# EAGLE design input-shield_for_Adafruit_HUZZAH32_ESP32_Feather (EAGLE 9.4.0)
COMPANY: PIKSU TECH; DRAWN: KTOWN; REV: A; TITLE: INPUT SHIELD; YEAR: 2019
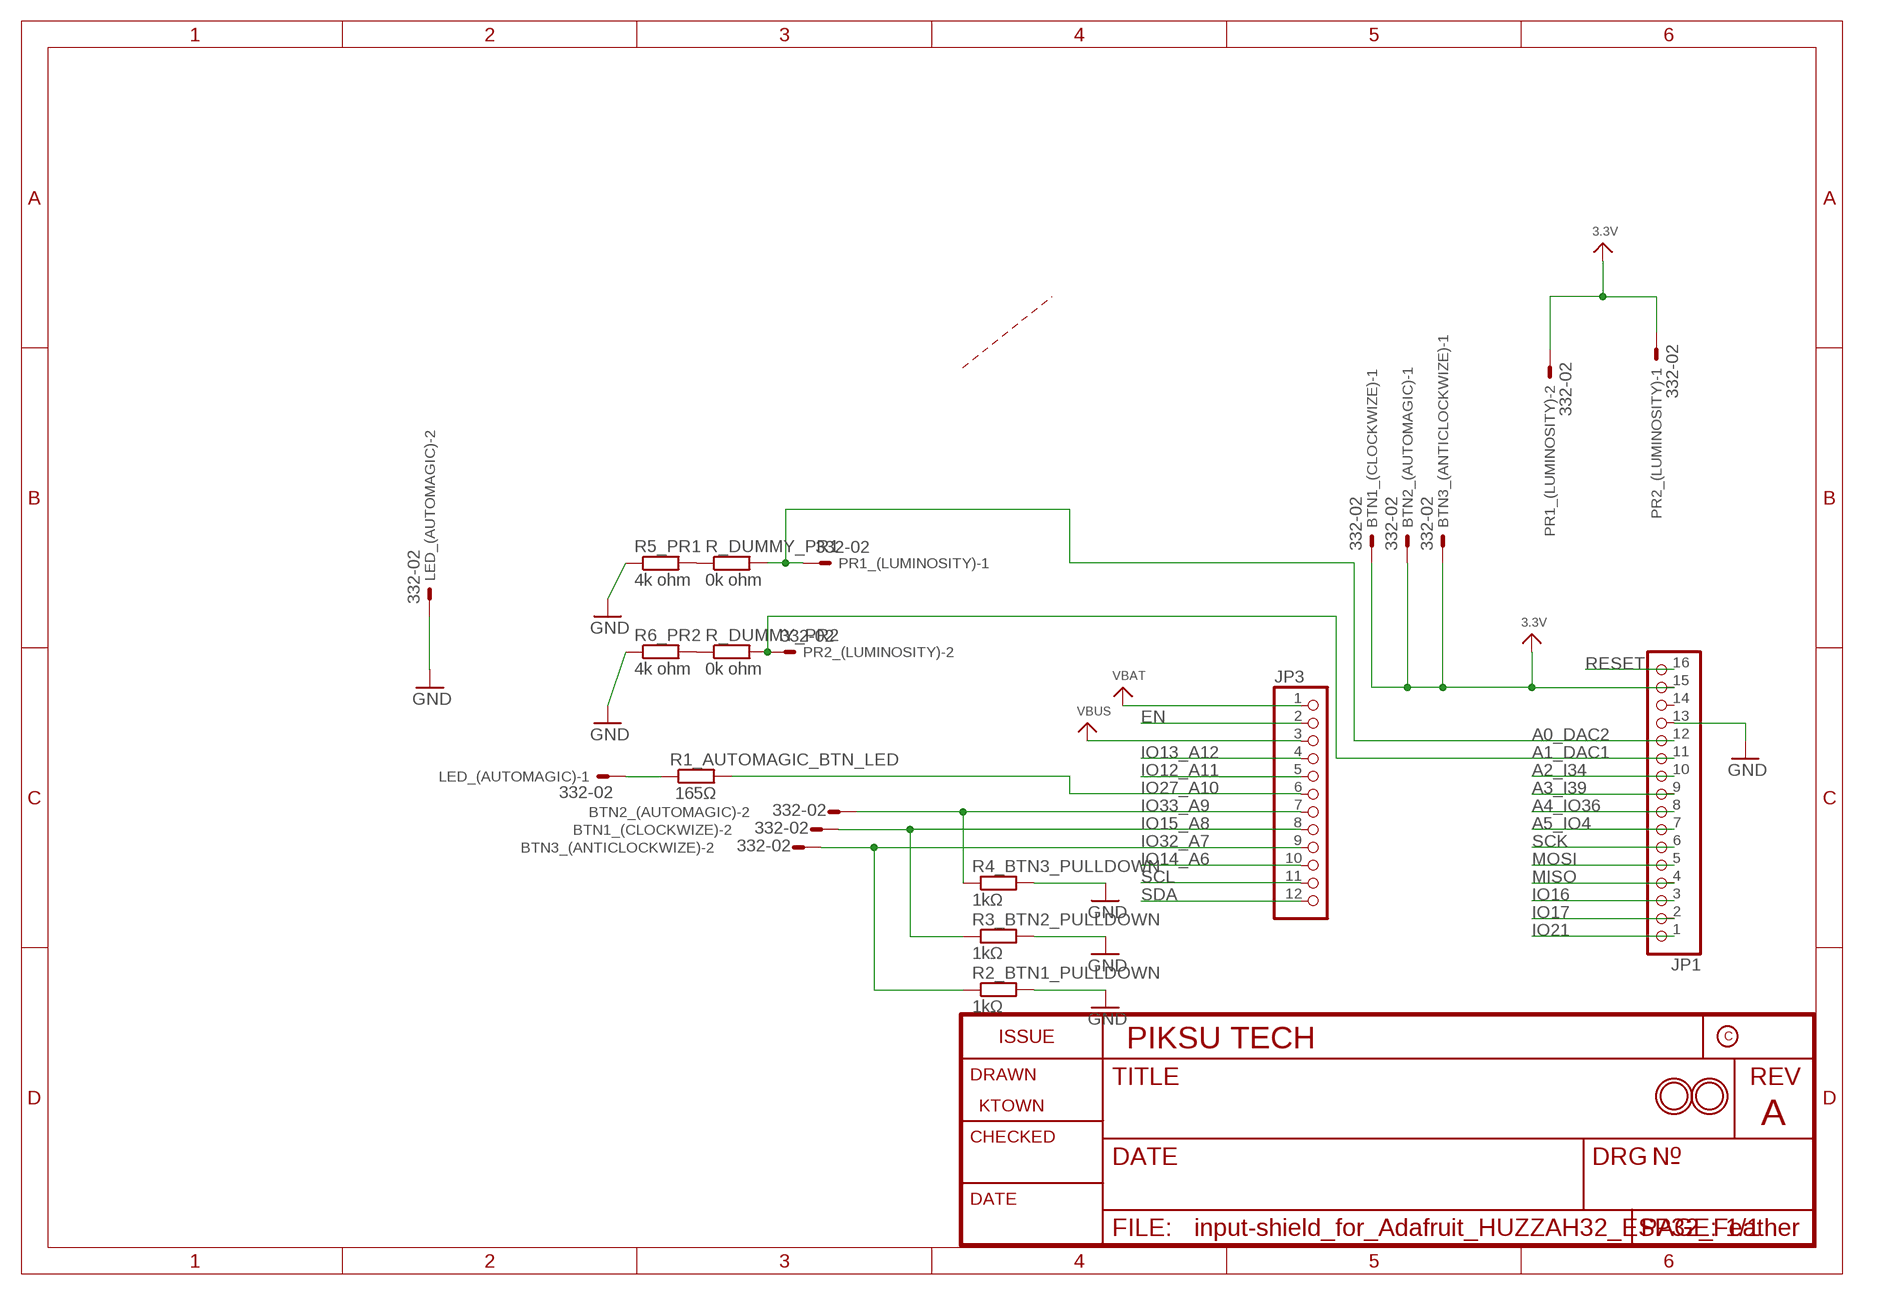
[diagram p0: schematic, sheet 1]

## Parts
BTN1_(CLOCKWIZE)  332-02  [332-02]
BTN2_(AUTOMAGIC)  332-02  [332-02]
BTN3_(ANTICLOCKWIZE)  332-02  [332-02]
JP1  HEADER-1X16_MIN  [1X16_ROUND_MIN]
JP3  HEADER-1X12_MIN  [1X12_ROUND_MIN]
LED_(AUTOMAGIC)  332-02  [332-02]
PR1_(LUMINOSITY)  332-02  [332-02]
PR2_(LUMINOSITY)  332-02  [332-02]
R1_AUTOMAGIC_BTN_LED  165Ω  R-EU_0204/7  [0204/7]
R2_BTN1_PULLDOWN  1kΩ  R-EU_0204/7  [0204/7]
R3_BTN2_PULLDOWN  1kΩ  R-EU_0204/7  [0204/7]
R4_BTN3_PULLDOWN  1kΩ  R-EU_0204/7  [0204/7]
R5_PR1  4k ohm  R-EU_0204/7  [0204/7]
R6_PR2  4k ohm  R-EU_0204/7  [0204/7]
R_DUMMY_PR1  0k ohm  R-EU_0204/7  [0204/7]
R_DUMMY_PR2  0k ohm  R-EU_0204/7  [0204/7]
U$31  MOUNTINGHOLE2.5  [MOUNTINGHOLE_2.5_PLATED]
U$32  MOUNTINGHOLE2.5  [MOUNTINGHOLE_2.5_PLATED]

## Nets
3.3V: BTN1_(CLOCKWIZE).1 BTN2_(AUTOMAGIC).1 BTN3_(ANTICLOCKWIZE).1 JP1.15 PR1_(LUMINOSITY).2 PR2_(LUMINOSITY).1
A0_DAC2: JP1.12 PR1_(LUMINOSITY).1 R_DUMMY_PR1.2
A1_DAC1: JP1.11 PR2_(LUMINOSITY).2 R_DUMMY_PR2.2
A2_I34: JP1.10
A3_I39: JP1.9
A4_IO36: JP1.8
A5_IO4: JP1.7
EN: JP3.2
GND: JP1.13 LED_(AUTOMAGIC).2 R2_BTN1_PULLDOWN.2 R3_BTN2_PULLDOWN.2 R4_BTN3_PULLDOWN.2 R5_PR1.1 R6_PR2.1
IO12_A11: JP3.5
IO13_A12: JP3.4
IO14_A6: JP3.10
IO15_A8: BTN1_(CLOCKWIZE).2 JP3.8 R3_BTN2_PULLDOWN.1
IO16: JP1.3
IO17: JP1.2
IO21: JP1.1
IO27_A10: JP3.6 R1_AUTOMAGIC_BTN_LED.2
IO32_A7: BTN3_(ANTICLOCKWIZE).2 JP3.9 R2_BTN1_PULLDOWN.1
IO33_A9: BTN2_(AUTOMAGIC).2 JP3.7 R4_BTN3_PULLDOWN.1
MISO: JP1.4
MOSI: JP1.5
N$1: LED_(AUTOMAGIC).1 R1_AUTOMAGIC_BTN_LED.1
N$4: R5_PR1.2 R_DUMMY_PR1.1
N$5: R6_PR2.2 R_DUMMY_PR2.1
RESET: JP1.16
SCK: JP1.6
SCL: JP3.11
SDA: JP3.12
VBAT: JP3.1
VBUS: JP3.3
Unconnected: JP1.14

## Library data of the parts
BTN1_(CLOCKWIZE) BTN2_(AUTOMAGIC) BTN3_(ANTICLOCKWIZE) LED_(AUTOMAGIC) PR1_(LUMINOSITY) PR2_(LUMINOSITY) = con-garry:332-02: 2 Pin - 2mm Dual Row Source: www.mpe-connector.de / garry_shortform_2012.pdf
JP1 = microbuilder:HEADER-1X16: PIN HEADER
JP3 = microbuilder:HEADER-1X12
R1_AUTOMAGIC_BTN_LED R2_BTN1_PULLDOWN R3_BTN2_PULLDOWN R4_BTN3_PULLDOWN R5_PR1 R6_PR2 R_DUMMY_PR1 R_DUMMY_PR2 = rcl:R-EU_: RESISTOR, European symbol; SPICEPREFIX: R
U$31 U$32 = microbuilder:MOUNTINGHOLE: Mounting Hole For #2 screws (0.086"/2.18mm width, 0.094"/2.4mm hole) use 2.5mm; BOM: EXCLUDE

## Board
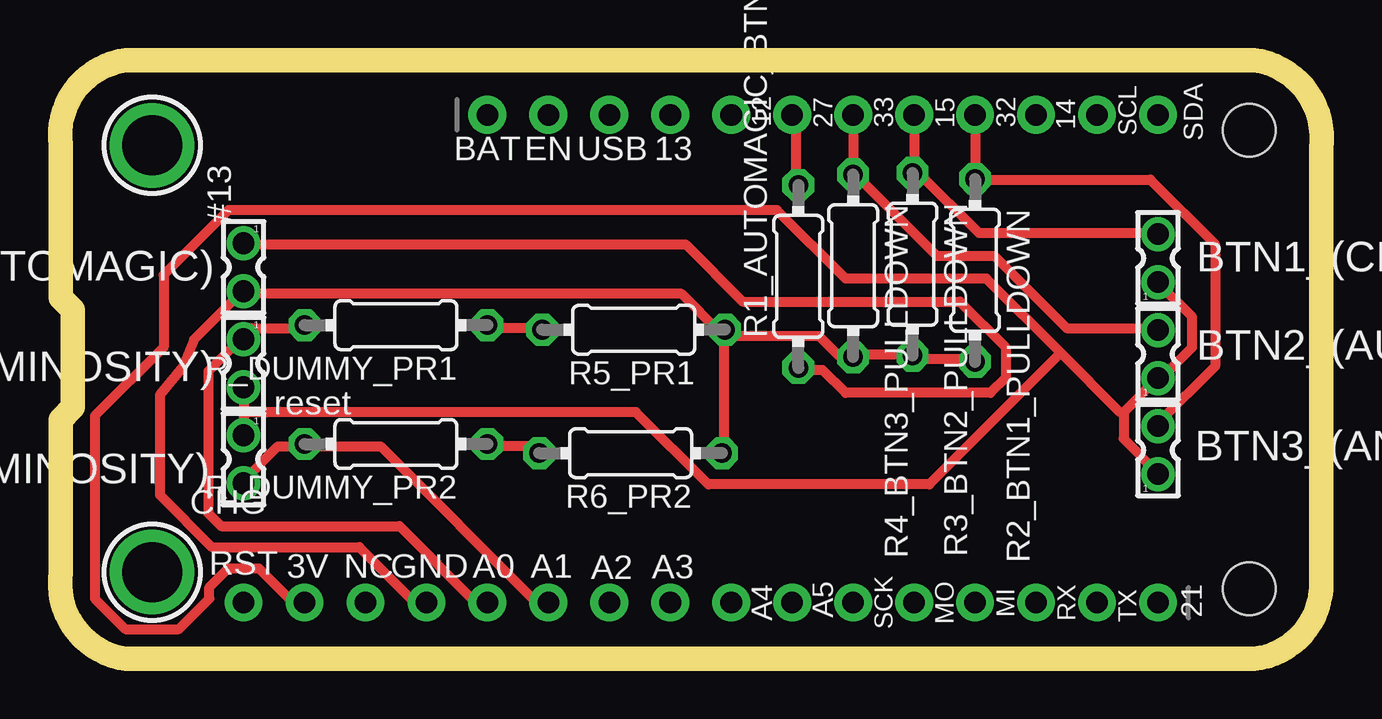
[diagram p1: board, top side]

Size 52.57 x 24.96 mm. Coordinates in mm from the lower left corner, seen from the top.
Outline: 2.76,0 49.75,0 arc90 52.54,3.49 52.54,21.27 arc90 49.75,24.96 2.76,24.96 arc90 0.03,21.4 0.03,15.05 0.54,14.54 0.54,10.48 0.03,9.97 0.03,3.62 arc90 2.76,0
Copper layers (1*16): Top 0.035mm / dielectric 1.5mm / Bottom 0.035mm
Design rules "adafruit 7-7 *": minimum track width 16mil, minimum drill 15.5mil, track to track 16mil, track to pad 16mil, pad to pad 16mil, via to via 16mil, smd to smd 7mil, copper to edge 10mil, drill to drill 8mil, minimum pad ring 10mil, minimum via ring 8mil, stop-mask expansion 2mil, vias tented up to drill 20mil, thermal gap 10mil
Holes 2.2 mm at 49.56,2.92 49.56,22.03

### Footprints (pad centres in the part's own frame; a part is rotated, then mirrored left to right if it is on the bottom)
332-02 = drill 0.9 pad 1.27: 1 0,-1; 2 0,1
1X16_ROUND_MIN = drill 0.9 pad 1.575: 1 -19.05,0; 2 -16.51,0; 3 -13.97,0; 4 -11.43,0; 5 -8.89,0; 6 -6.35,0; 7 -3.81,0; 8 -1.27,0; 9 1.27,0; 10 3.81,0; 11 6.35,0; 12 8.89,0; 13 11.43,0; 14 13.97,0; 15 16.51,0; 16 19.05,0
1X12_ROUND_MIN = drill 0.9 pad 1.575: 1 -13.97,0; 2 -11.43,0; 3 -8.89,0; 4 -6.35,0; 5 -3.81,0; 6 -1.27,0; 7 1.27,0; 8 3.81,0; 9 6.35,0; 10 8.89,0; 11 11.43,0; 12 13.97,0
0204/7 = drill 0.813 octagon: 1 -3.81,0; 2 3.81,0
MOUNTINGHOLE_2.5_PLATED = drill 2.5 pad 3.2: P$1 0,0

### Placement (x,y rotation side)
BTN1_(CLOCKWIZE)  45.75,16.7 0 top
BTN2_(AUTOMAGIC)  45.75,12.7 0 top
BTN3_(ANTICLOCKWIZE)  45.75,8.7 0 top
JP1  26.7,2.35 180 top
JP3  31.78,22.67 0 top
LED_(AUTOMAGIC)  7.65,16.32 180 top
PR1_(LUMINOSITY)  7.65,12.32 180 top
PR2_(LUMINOSITY)  7.65,8.32 180 top
R1_AUTOMAGIC_BTN_LED  30.76,15.94 90 top
R2_BTN1_PULLDOWN  38.13,16.19 270 top
R3_BTN2_PULLDOWN  35.52,16.45 270 top
R4_BTN3_PULLDOWN  33.05,16.38 270 top
R5_PR1  23.9,13.72 180 top
R6_PR2  23.78,8.57 180 top
R_DUMMY_PR1  14,13.91 180 top
R_DUMMY_PR2  14,8.95 180 top
U$31  3.84,21.4 270 top
U$32  3.84,3.62 270 top

### Tracks (layer width: path | path; a pad name or v marks a point on that pad's centre or on a via)
3.3V
  Top 0.406: PR1_(LUMINOSITY).2 7.65,10.29 | 7.65,10.29 PR2_(LUMINOSITY).1 | 44.32,10.29 44.32,9.18 45.75,7.75 BTN3_(ANTICLOCKWIZE).1 | 44.32,10.29 45.75,11.72 BTN2_(AUTOMAGIC).1 45.91,11.72 47.18,12.99 47.18,14.26 45.75,15.68 BTN1_(CLOCKWIZE).1 | JP1.15 9.71,2.35 8.28,3.78 7.01,3.78 6.22,2.98 6.22,2.51 4.95,1.24 2.73,1.24 1.46,2.51 1.46,10.13 4.31,12.99 4.31,16 7.01,18.7 29.87,18.7 32.73,15.84 38.6,15.84 41.7,12.75 | 41.7,12.75 44.16,10.29 44.32,10.29 | 7.65,10.29 24,10.29 27.02,7.27 36.22,7.27 41.7,12.75
A0_DAC2
  Top 0.406: R_DUMMY_PR1.2 10.19,13.78 7.97,13.78 7.65,13.46 PR1_(LUMINOSITY).1 7.49,13.3 6.18,11.99 6.18,6.06 6.71,5.53 14.15,5.53 17.33,2.35 JP1.12
A1_DAC1
  Top 0.406: PR2_(LUMINOSITY).2 7.65,7.43 9.08,8.86 10.19,8.86 R_DUMMY_PR2.2 10.35,8.86 13.36,8.86 19.87,2.35 JP1.11
GND
  Top 0.406: R2_BTN1_PULLDOWN.2 38.13,12.51 35.59,12.51 R3_BTN2_PULLDOWN.2 35.43,12.67 33.05,12.67 R4_BTN3_PULLDOWN.2 32.89,12.67 32.41,12.67 31.62,13.46 27.81,13.46 R5_PR1.1 | R6_PR2.1 27.65,8.7 27.65,13.62 R5_PR1.1 | R5_PR1.1 27.49,13.62 25.9,15.21 7.65,15.21 LED_(AUTOMAGIC).2 7.49,15.21 5.59,13.31 5.13,12.19 4.16,11.01 4.16,6.83 6.33,4.66 12.48,4.66 14.79,2.35 JP1.13
IO15_A8
  Top 0.406: JP3.8 35.59,20.29 R3_BTN2_PULLDOWN.1 35.75,20.29 38.29,17.75 45.75,17.75 BTN1_(CLOCKWIZE).2
IO27_A10
  Top 0.406: JP3.6 30.67,22.51 30.67,19.81 R1_AUTOMAGIC_BTN_LED.2
IO32_A7
  Top 0.406: JP3.9 R2_BTN1_PULLDOWN.1 38.29,19.97 45.43,19.97 48.13,17.27 48.13,12.19 45.75,9.81 BTN3_(ANTICLOCKWIZE).2
IO33_A9
  Top 0.406: JP3.7 R4_BTN3_PULLDOWN.1 33.21,20.13 36.54,16.8 38.92,16.8 41.94,13.78 45.75,13.78 BTN2_(AUTOMAGIC).2
N$1
  Top 0.406: R1_AUTOMAGIC_BTN_LED.1 30.82,12.03 31.78,12.03 32.73,11.08 38.76,11.08 39.4,11.72 39.4,12.99 37.49,14.89 28.44,14.89 26.06,17.27 7.65,17.27 LED_(AUTOMAGIC).1
N$4
  Top 0.406: R_DUMMY_PR1.1 17.81,13.78 20.03,13.78 R5_PR1.2
N$5
  Top 0.406: R_DUMMY_PR2.1 17.81,8.86 19.71,8.86 19.87,8.7 R6_PR2.2

### Text on the board
tPlace: 12 | 27 | 33 | 15 | 32 | 14 | SCL | SDA | BAT | EN | USB | 13 | #13 | reset | CHG | RST | 3V | NC | GND | A0 | A1 | A2 | A3 | A4 | A5 | SCK | MO | MI | RX | TX | 21